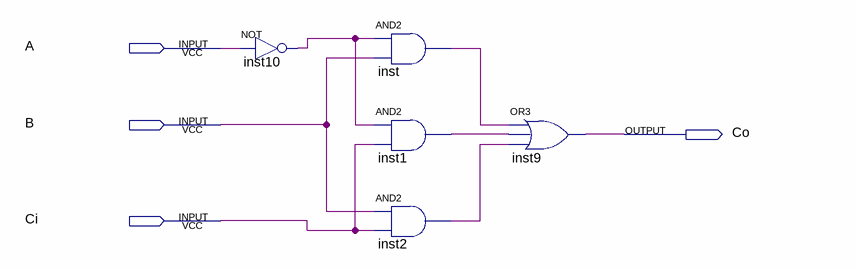
[diagram p0: schematic sheet]
// Quartus schematic menorQue_Bit.bdf as structural Verilog: 5 symbols, 4 pins
module menorQue_Bit (
  input  A,
  input  B,
  input  Ci,
  output Co
);

  wire inst1_out, inst2_out, inst10_out, inst_out;

  not inst10 (inst10_out, A);
  and inst (inst_out, inst10_out, B);
  and inst1 (inst1_out, inst10_out, Ci);
  and inst2 (inst2_out, B, Ci);
  or inst9 (Co, inst_out, inst1_out, inst2_out);
endmodule
